# EAGLE design xc2401_breakout (EAGLE 6.2)
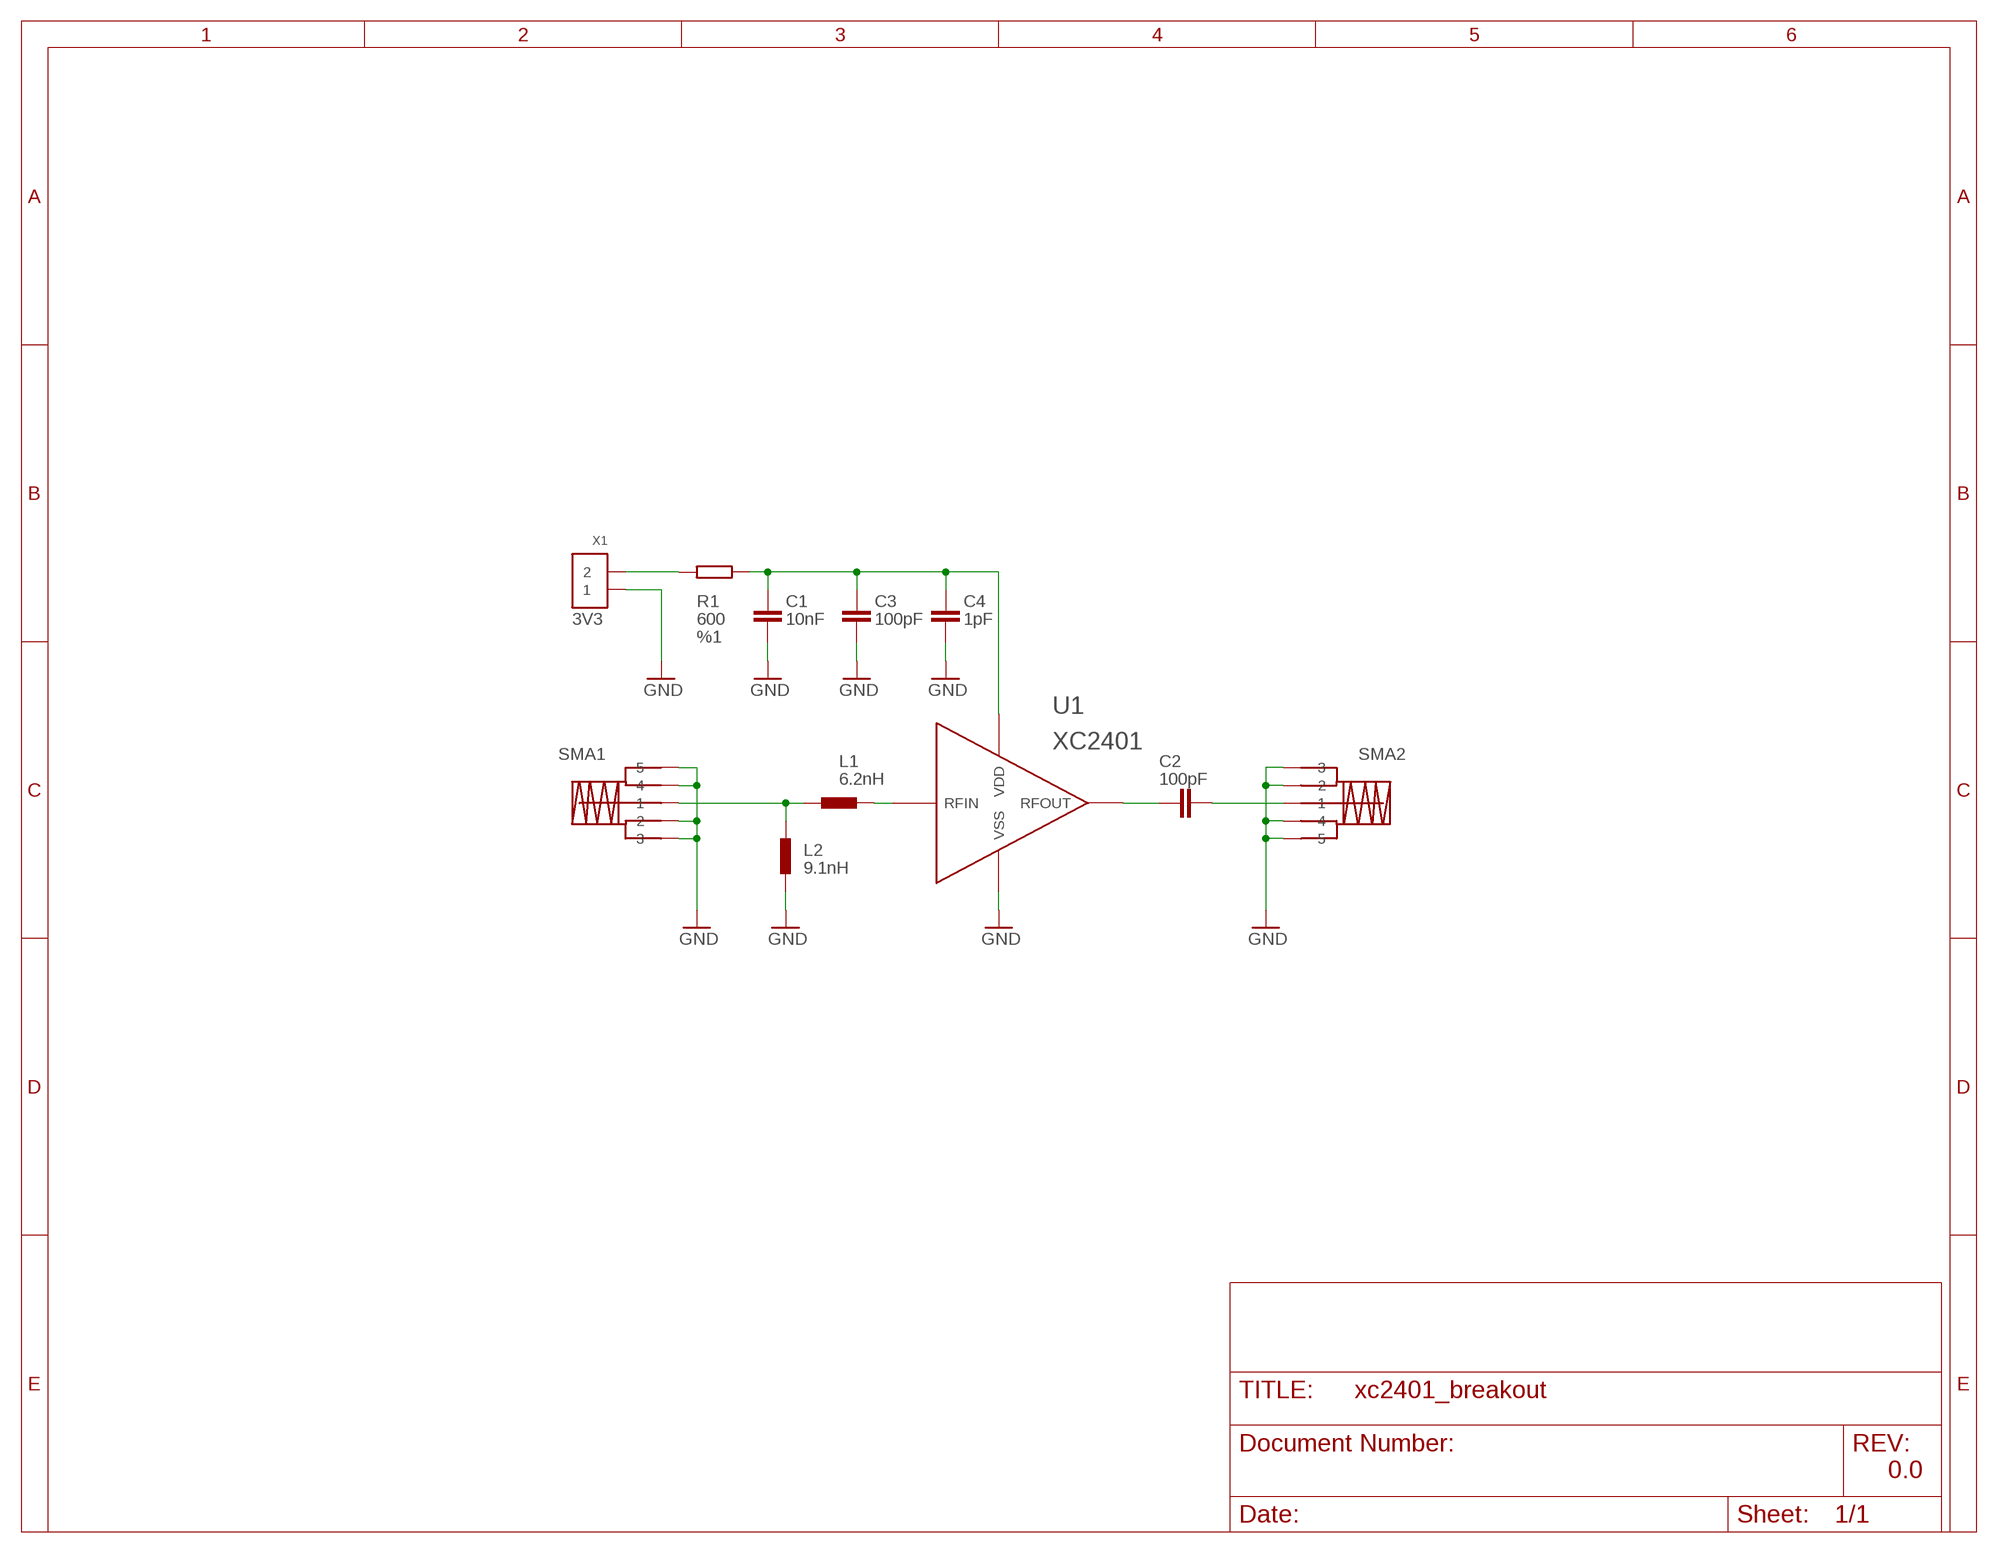
[diagram p0: schematic, sheet 1]

## Parts
C1  10nF  CAPACITOR-0402  [0402-CAP]
C2  100pF  CAPACITOR-0402  [0402-CAP]
C3  100pF  CAPACITOR-0402  [0402-CAP]
C4  1pF  CAPACITOR-0402  [0402-CAP]
L1  6.2nH  INDUCTOR-0402  [0402-IND]
L2  9.1nH  INDUCTOR-0402  [0402-IND]
R1  600  RESISTOR-0402  [0402-RES]
SMA1  SMA_EDGE  [SMA_EDGE]
SMA2  SMA_EDGE  [SMA_EDGE]
U1  XC2401  [XC2401]
X1  CONN_2-1-53261  [PB-53261-02]

## Nets
GND: C1.P$2 C3.P$2 C4.P$2 L2.P$1 SMA1.P2 SMA1.P3 SMA1.P4 SMA1.P5 SMA2.P2 SMA2.P3 SMA2.P4 SMA2.P5 U1.3(VSS) X1.1
N$1: C1.P$1 C3.P$1 C4.P$1 R1.P$2 U1.1(VDD)
N$2: C2.P$1 U1.2(RFOUT)
N$3: C2.P$2 SMA2.P1
N$4: L1.P$1 L2.P$2 SMA1.P1
N$5: L1.P$2 U1.4(RFIN)
N$6: R1.P$1 X1.2

## Notes on the sheet
- 3V3
- %1
- 0.0

## Library data of the parts
C1-C4 = pel_dipol_comp:CAPACITOR
L1 L2 = pel_dipol_comp:INDUCTOR
R1 = pel_dipol_comp:RESISTOR
SMA1 SMA2 = swift-nav:SMA_EDGE
U1 = swift-nav:XC2401
X1 = pel_molex:CONN_2-1

## Board
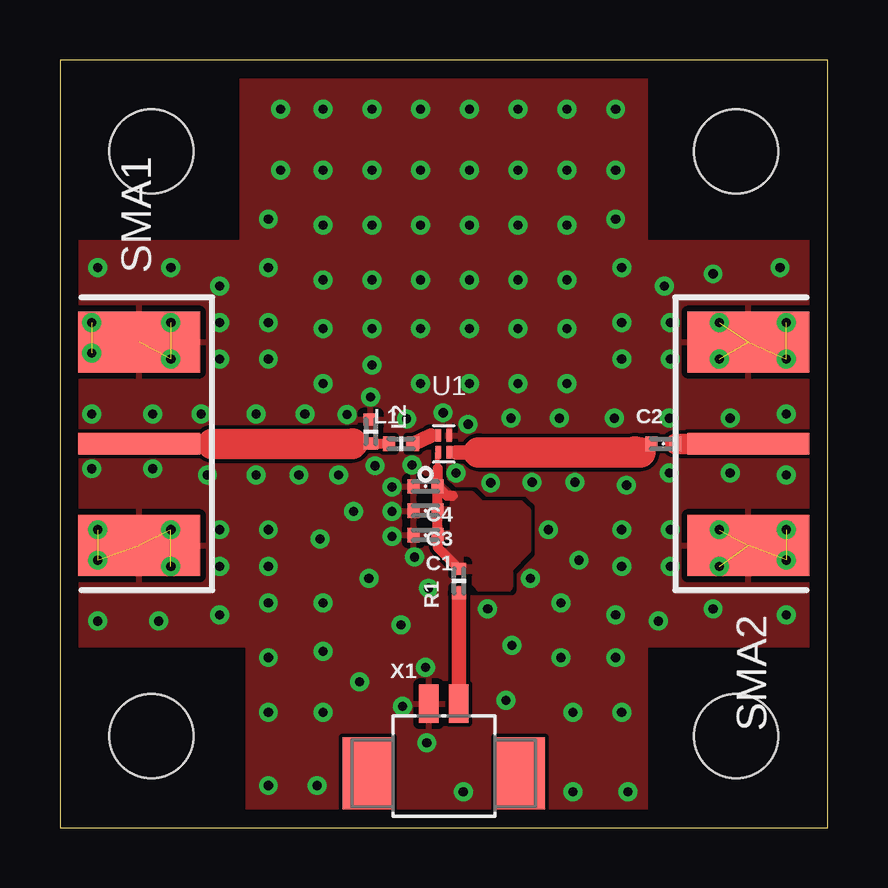
[diagram p1: board, top side]
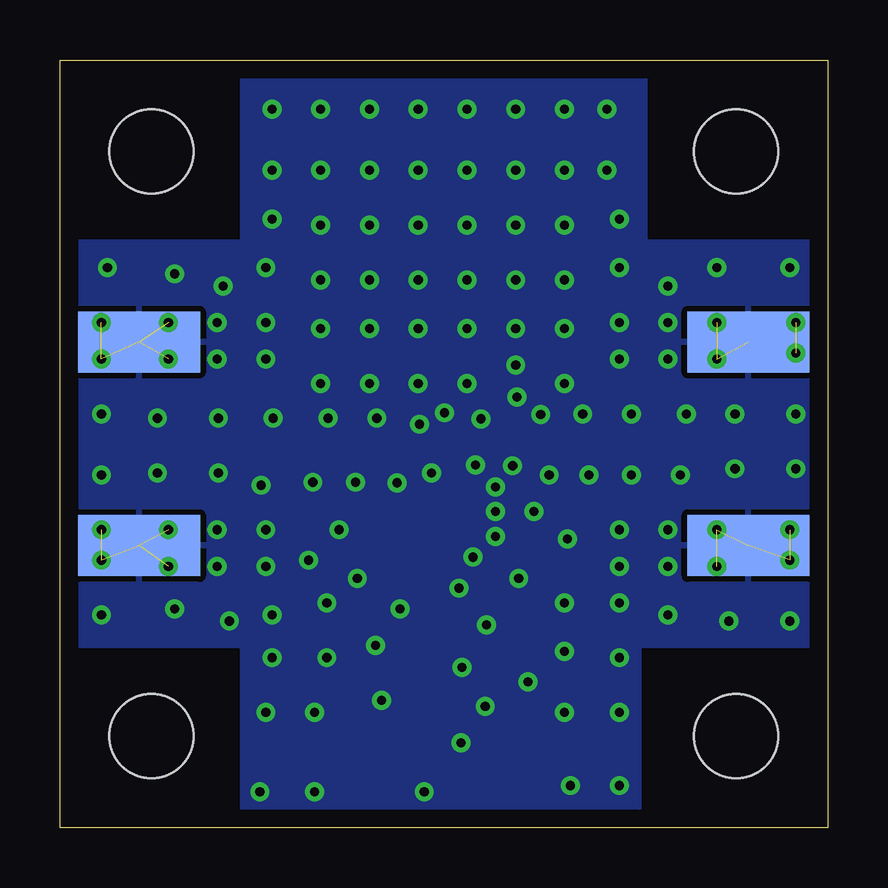
[diagram p2: board, bottom side, seen from below]

Size 32 x 32 mm. Coordinates in mm from the lower left corner, seen from the top.
Outline: 0,32 0,0 32,0 32,32 0,32
Copper layers (1*16): Top 0.035mm / dielectric 1.5mm / Bottom 0.035mm
Design rules: minimum track width 6mil, minimum drill 15mil, track to track 6mil, track to pad 6mil, pad to pad 6mil, via to via 6mil, smd to smd 6mil, copper to edge 30mil, drill to drill 8mil, minimum pad ring 10mil, minimum via ring 8mil, stop-mask expansion 4mil, vias tented up to drill 0mil, thermal gap 10mil
Holes 3.5 mm at 3.81,3.81 28.19,3.81 3.81,28.19 28.19,28.19

### Footprints (pad centres in the part's own frame; a part is rotated, then mirrored left to right if it is on the bottom)
0402-CAP = smd 0.5 x 0.6: P$1 -0.5,0; P$2 0.5,0
0402-IND = smd 0.5 x 0.6: P$1 -0.5,0; P$2 0.5,0
0402-RES = smd 0.5 x 0.6: P$1 -0.5,0; P$2 0.5,0
SMA_EDGE = smd 0.889 x 5.08: P1 0,-2.54 | smd 2.54 x 5.08: P2 -4.242,-2.54; P3 4.242,-2.54 | smd 2.54 x 5.08 bottom: P4 -4.242,-2.54; P5 4.242,-2.54
XC2401 = smd 0.229 x 0.508: 1 -0.229,-0.356; 2 0.229,-0.356; 3 0.229,0.356; 4 -0.229,0.356
PB-53261-02 = smd 0.8 x 1.6: 1 -0.625,1.1; 2 0.625,1.1 | smd 2.1 x 3: MNT1 -3.175,-1.8; MNT2 3.175,-1.8

### Placement (x,y rotation side)
C1  15.24,12.19 180 top
C2  25.15,16 0 top
C3  15.24,13.21 180 top
C4  15.24,14.22 180 top
L1  14.22,16 0 top
L2  12.95,16.51 270 top
R1  16.64,10.29 90 top
SMA1  0.76,16 90 top
SMA2  31.24,16 270 top
U1  16,16 0 top
X1  16,4.06 0 top

### Tracks (layer width: path | path; a pad name or v marks a point on that pad's centre or on a via)
GND  (via drill 0.38)  (15 unrouted)
  other vias: 13.13,15.09 11.61,14.71 10.21,17.25 11.96,17.22 12.95,17.96 14.45,17.04 14.68,15.11 13.84,14.2 13.84,13.18 13.84,12.14 17.96,14.38 15.98,17.3 17.02,16.81 5.89,17.25 3.86,17.25 9.96,14.71 6.15,14.71 3.86,14.96 18.8,17.07 20.83,17.07 16.51,14.78 19.68,14.4 21.46,14.4 23.62,14.27 25.4,14.78 27.94,14.78 27.94,17.07 25.4,17.07 23.11,17.07 4.62,19.53 6.65,19.53 8.69,19.53 8.69,21.06 6.65,21.06 4.62,21.06 4.62,12.42 6.65,12.42 8.69,12.42 8.69,10.9 6.65,10.9 4.62,10.9 15.37,9.98 14.22,8.46 15.24,6.68 9.19,27.41 15.04,25.12 13,25.12 10.97,25.12 8.69,25.37 8.69,23.34 6.65,22.58 4.62,23.34 15.04,22.83 13,22.83 10.97,22.83 15.04,27.41 13,27.41 10.97,27.41 21.13,27.41 19.1,27.41 17.07,27.41 21.13,25.12 19.1,25.12 17.07,25.12 21.13,22.83 19.1,22.83 17.07,22.83 27.23,23.09 25.2,22.58 23.42,23.34 23.16,25.37 23.16,27.41 21.13,20.8 19.1,20.8 17.07,20.8 15.04,20.8 13,20.8 10.97,20.8 13,19.28 21.13,18.52 19.1,18.52 17.07,18.52 15.04,18.52 10.97,18.52 8.69,9.37 6.65,8.86 4.11,8.61 8.69,7.09 8.69,4.8 12.5,6.07 10.97,9.37 10.97,4.8 24.94,8.61 23.16,8.86 20.88,9.37 27.23,9.12 23.16,7.09 20.88,7.09 23.42,4.8 21.39,4.8 10.85,12.04 14.78,11.28 10.97,7.34 17.83,9.12 15.29,3.53 14.27,5.05 20.37,12.42 21.64,11.15 19.61,10.39 18.85,7.59 8.18,17.25 8.18,14.71 12.24,13.18 12.88,10.39 10.72,1.75 8.69,1.75 16.81,1.5 21.39,1.5 23.67,1.5 30.28,8.86 30.28,11.15 30.28,12.42 30.28,14.71 30.28,17.25 30.28,19.53 30.28,21.06 30.02,23.34 23.42,19.53 25.45,19.53 27.48,19.53 27.48,21.06 25.45,21.06 23.42,21.06 23.42,10.9 25.45,10.9 27.48,10.9 27.48,12.42 25.45,12.42 23.42,12.42 9.19,29.95 15.04,29.95 13,29.95 10.97,29.95 21.13,29.95 19.1,29.95 17.07,29.95 23.16,29.95 18.59,5.31 1.57,8.61 1.57,11.15 1.57,12.42 1.32,14.96 1.32,17.25 1.32,19.79 1.32,21.06 1.57,23.34
  pour Top (isolate 0.152, rank 2): -0.25,24.38 7.62,24.38 7.62,32.26 24.38,32.26 24.38,24.38 32.26,24.38 32.26,7.62 24.38,7.62 24.38,-0.25 7.87,-0.25 7.87,7.62 -0.25,7.62
  pour Bottom: -0.25,24.38 7.62,24.38 7.62,32.26 24.38,32.26 24.38,24.38 32.26,24.38 32.26,7.62 24.38,7.62 24.38,-0.25 7.87,-0.25 7.87,7.62 -0.51,7.62
N$1
  Top 0.203: 15.75,14.99 15.75,15.62 U1.1
  Top 0.406: 15.75,14.99 15.75,14.24 arc-45 C4.P$1 | C4.P$1 C3.P$1 C1.P$1 15.74,11.68 R1.P$2 | C4.P$1 16.12,13.84 16.38,13.84
  pour Top: 15.75,14.35 16.26,13.84 17.14,13.84 17.53,13.46 19.18,13.46 19.43,13.21 19.43,11.56 18.67,10.79 18.67,10.03 17.53,10.03 15.75,11.81
N$2
  Top 0.203: U1.2 16.51,15.65
  Top 0.254: 23.98,15.67 24.32,15.67 C2.P$1
  Top 0.61: 16.51,15.65 17.45,15.65
  Top 1.27: 17.45,15.65 24.21,15.65 23.98,15.67
N$3
  Top 0.864: C2.P$2 SMA2.P1
N$4
  Top 0.254: SMA1.P1 6.35,16
  Top 0.406: 12.19,16 12.19,16.01 L2.P$2 L1.P$1
  Top 1.27: 6.35,16 12.18,16 12.19,16.01
N$5
  Top 0.203: 15.47,16.36 U1.4 15.8,16.36
  Top 0.61: L1.P$2 15.47,16.36
N$6
  Top 0.61: R1.P$1 16.63,9.78 X1.2